# Altium schematic sheet 7h - Software Communication.SchDoc
size A4
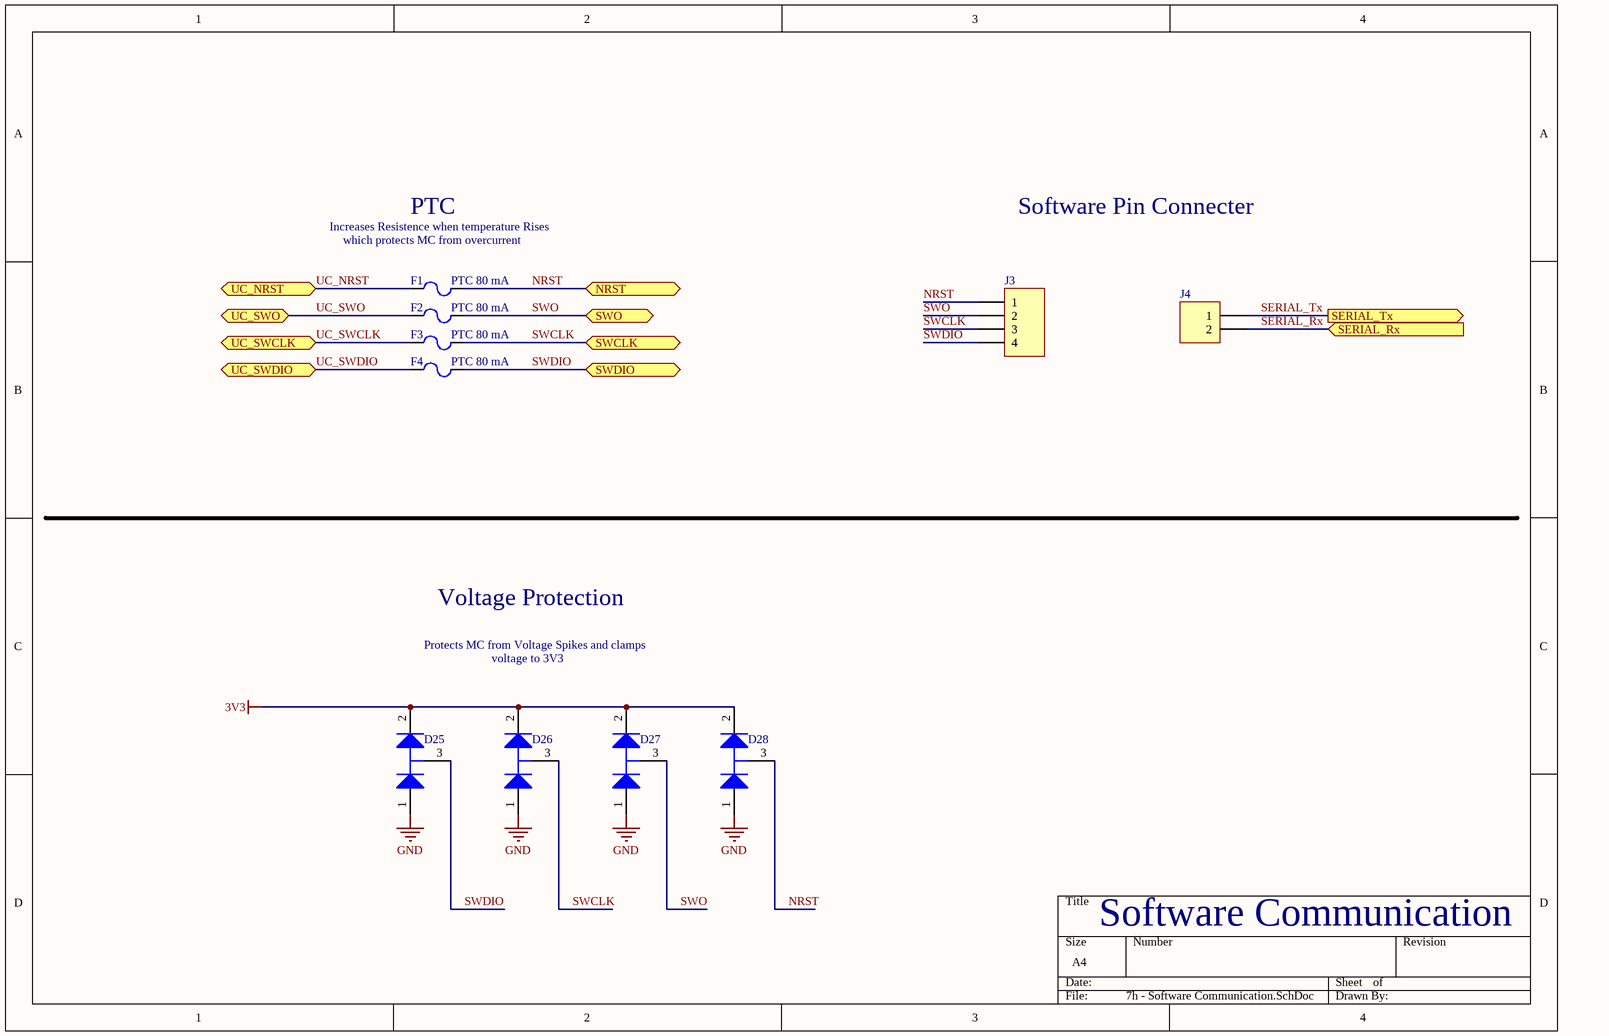
[diagram p0: 7h - Software Communication.SchDoc]

## Parts
D25  SZNUP1301ML3T1G  [ONSC-SOT-23-3-318-08_V]  (value not drawn)
D26  SZNUP1301ML3T1G  [ONSC-SOT-23-3-318-08_V]  (value not drawn)
D27  SZNUP1301ML3T1G  [ONSC-SOT-23-3-318-08_V]  (value not drawn)
D28  SZNUP1301ML3T1G  [ONSC-SOT-23-3-318-08_V]  (value not drawn)
F1  PTC 80 mA  [FUSC1608X100N]
F2  PTC 80 mA  [FUSC1608X100N]
F3  PTC 80 mA  [FUSC1608X100N]
F4  PTC 80 mA  [FUSC1608X100N]
J3  Header 4  [HDR1X4]  (value not drawn)
J4  (no value)  [HDR1X2]

## Ports
NRST (bidir), SERIAL_Rx (in), SERIAL_Tx (out), SWCLK (bidir), SWDIO (bidir), SWO (bidir), UC_NRST (bidir), UC_SWCLK (bidir), UC_SWDIO (bidir), UC_SWO (bidir)

## Nets
3V3: D25.2(K) D26.2(K) D27.2(K) D28.2(K)
GND: D25.1(A) D26.1(A) D27.1(A) D28.1(A)
NRST: D28.3(K/A) F1.2 J3.1 ; port NRST
SERIAL_Rx: J4.2 ; port SERIAL_Rx
SERIAL_Tx: J4.1 ; port SERIAL_Tx
SWCLK: D26.3(K/A) F3.2 J3.3 ; port SWCLK
SWDIO: D25.3(K/A) F4.2 J3.4 ; port SWDIO
SWO: D27.3(K/A) F2.2 J3.2 ; port SWO
UC_NRST: F1.1 ; port UC_NRST
UC_SWCLK: F3.1 ; port UC_SWCLK
UC_SWDIO: F4.1 ; port UC_SWDIO
UC_SWO: F2.1 ; port UC_SWO

## Notes on the sheet
- Increases Resistence when temperature Rises
- (near F1) which protects MC from overcurrent
- PTC
- Software Pin Connecter
- Protects MC from Voltage Spikes and clamps
- Voltage Protection
- voltage to 3V3
- Software Communication

## Library data of the parts
D25-D28 = CMP-1063-00171-1: Low Capacitance Diode Array for ESD Protection in a Single Data Line, 3-Pin SOT-23, Pb-Free, Tape and Reel; Manufacturer: On Semiconductor; C Max (pF): 0.9; Direction: Bidirectional; V(BR) Min (V): 70; Number of Lines: 1; Mounting Technology: Surface Mount; PackageReference: SOT-23-3-318-08; DatasheetVersion: Rev. 6; PackageVersion: Rev. AP, 11/2009; RoHS: Pb-Free; ComponentLink1Description: Manufacturer URL; ComponentLink1URL: http://www.onsemi.com/; PackageDescription: 3-Pin Small Outline Transistor, Body 2.92 x 1.3 mm, Pitch 0.95 mm; PartNumber: SZNUP1301ML3T1G; Packing: Tape and Reel; ComponentLink3URL: http://www.onsemi.cn/pub_link/Collateral/318-08.PDF; ComponentLink3Description: Package Specification; VRWM Max (V): 70; ComponentLink2Description: Datasheet; ComponentLink2URL: http://www.onsemi.cn/pub_link/Collateral/NUP1301ML3T1-D.PDF; Supplier 1: Mouser; Supplier Part Number 1: 863-SZNUP1301ML3T1G
F1-F4 = PTC fuse 80mA 0ZCM0008FF2G: 0ZCM0008FF2G; Supplier 1: Digi-Key; Supplier Part Number 1: 507-1817-1-ND
J3 = Header 4: Header, 4-Pin; LatestRevisionDate: 17-Jul-2002; LatestRevisionNote: Re-released for DXP Platform.; Publisher: Altium Limited
J4 = Header 2: Header, 2-Pin; LatestRevisionDate: 17-Jul-2002; LatestRevisionNote: Re-released for DXP Platform.; Publisher: Altium Limited